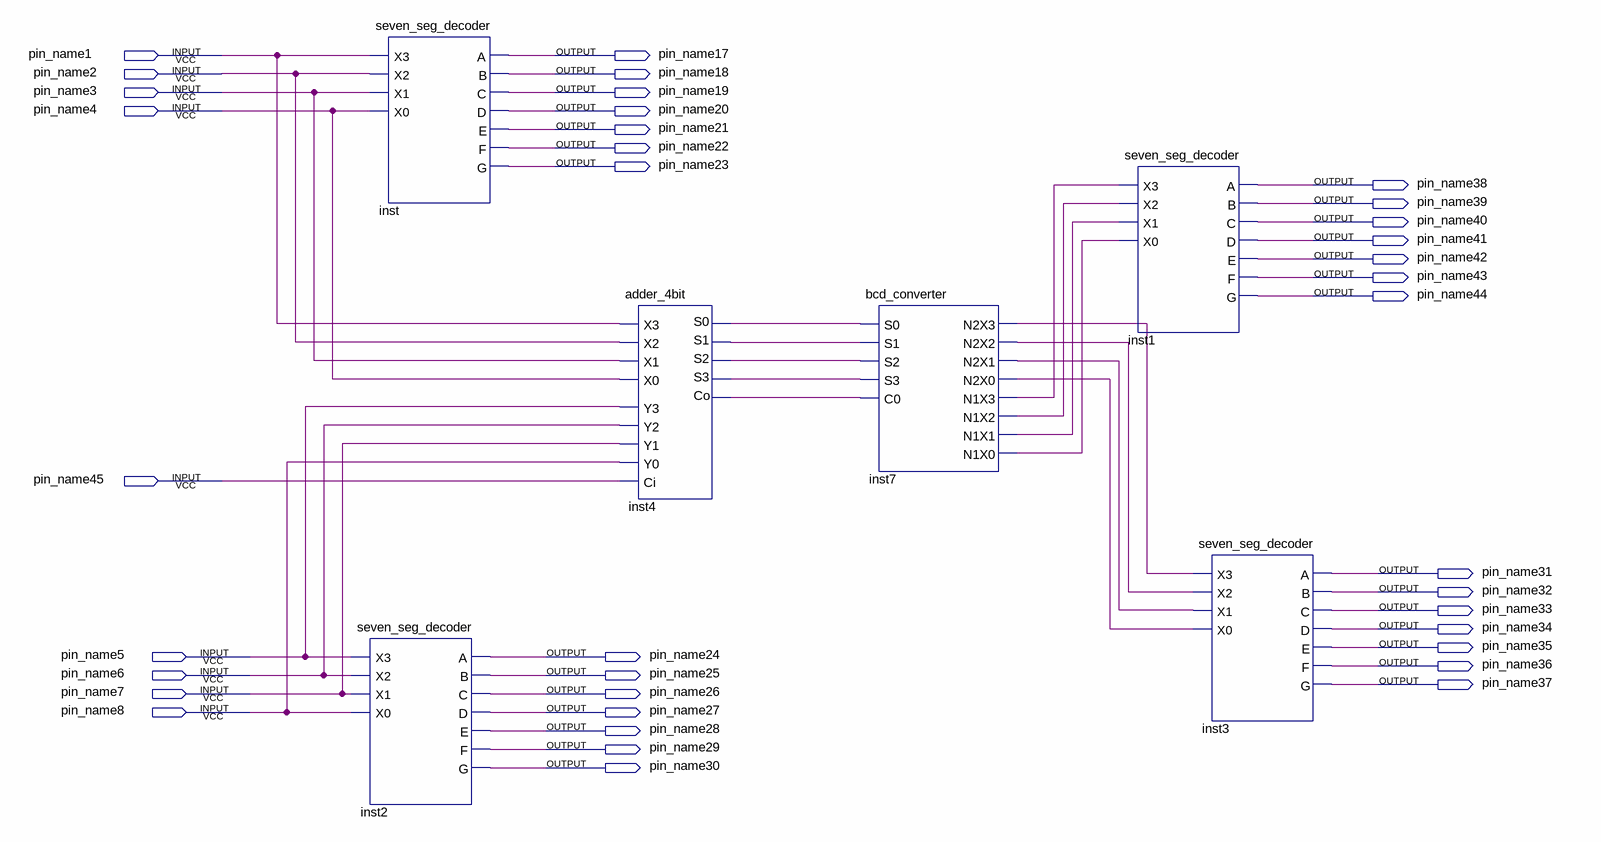
[diagram p0: schematic sheet]
// Quartus schematic Lab06.bdf as structural Verilog: 6 symbols, 37 pins
module Lab06 (
  input  pin_name1,
  input  pin_name2,
  input  pin_name3,
  input  pin_name4,
  input  pin_name45,
  input  pin_name5,
  input  pin_name6,
  input  pin_name7,
  input  pin_name8,
  output pin_name17,
  output pin_name18,
  output pin_name19,
  output pin_name20,
  output pin_name21,
  output pin_name22,
  output pin_name23,
  output pin_name38,
  output pin_name39,
  output pin_name40,
  output pin_name41,
  output pin_name42,
  output pin_name43,
  output pin_name44,
  output pin_name31,
  output pin_name32,
  output pin_name33,
  output pin_name34,
  output pin_name35,
  output pin_name24,
  output pin_name36,
  output pin_name25,
  output pin_name37,
  output pin_name26,
  output pin_name27,
  output pin_name28,
  output pin_name29,
  output pin_name30
);

  wire inst4_co, inst4_s0, inst4_s1, inst4_s2, inst4_s3, inst7_n1x0, inst7_n1x1, inst7_n1x2, inst7_n1x3,
       inst7_n2x0, inst7_n2x1, inst7_n2x2, inst7_n2x3;

  seven_seg_decoder inst2 (
    .X3(pin_name5), .X2(pin_name6), .X1(pin_name7), .X0(pin_name8), .A(pin_name24), .B(pin_name25),
    .C(pin_name26), .D(pin_name27), .E(pin_name28), .F(pin_name29), .G(pin_name30));
  seven_seg_decoder inst (
    .X3(pin_name1), .X2(pin_name2), .X1(pin_name3), .X0(pin_name4), .A(pin_name17), .B(pin_name18),
    .C(pin_name19), .D(pin_name20), .E(pin_name21), .F(pin_name22), .G(pin_name23));
  adder_4bit inst4 (
    .X3(pin_name1), .Y3(pin_name5), .X2(pin_name2), .Y2(pin_name6), .X1(pin_name3), .Y1(pin_name7),
    .X0(pin_name4), .Y0(pin_name8), .Ci(pin_name45), .S0(inst4_s0), .S1(inst4_s1), .S2(inst4_s2),
    .S3(inst4_s3), .Co(inst4_co));
  bcd_converter inst7 (
    .S0(inst4_s0), .S1(inst4_s1), .S2(inst4_s2), .S3(inst4_s3), .C0(inst4_co), .N2X3(inst7_n2x3),
    .N2X2(inst7_n2x2), .N2X1(inst7_n2x1), .N2X0(inst7_n2x0), .N1X3(inst7_n1x3), .N1X2(inst7_n1x2),
    .N1X1(inst7_n1x1), .N1X0(inst7_n1x0));
  seven_seg_decoder inst1 (
    .X3(inst7_n1x3), .X2(inst7_n1x2), .X1(inst7_n1x1), .X0(inst7_n1x0), .A(pin_name38), .B(pin_name39),
    .C(pin_name40), .D(pin_name41), .E(pin_name42), .F(pin_name43), .G(pin_name44));
  seven_seg_decoder inst3 (
    .X3(inst7_n2x3), .X2(inst7_n2x2), .X1(inst7_n2x1), .X0(inst7_n2x0), .A(pin_name31), .B(pin_name32),
    .C(pin_name33), .D(pin_name34), .E(pin_name35), .F(pin_name36), .G(pin_name37));
endmodule
